# EAGLE design Lixie_Master (EAGLE 7.7.0)
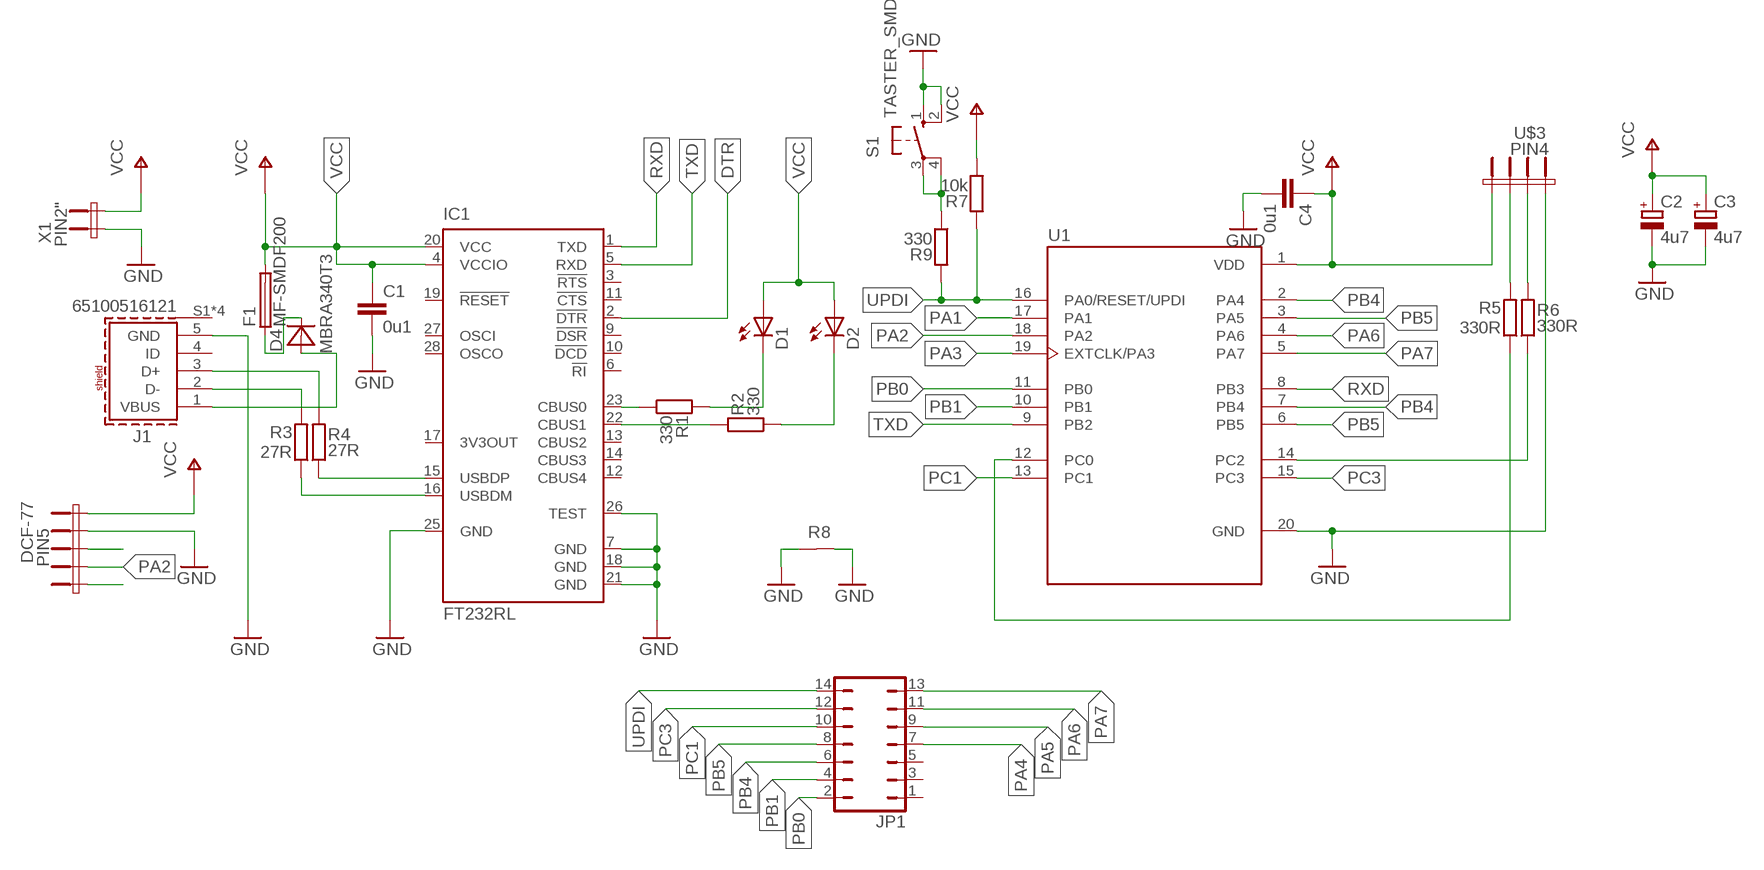
[diagram p0: schematic, sheet 1]

## Parts
C1  0u1  C-EUC0805  [C0805]
C2  4u7  CPOL-EU153CLV-0405  [153CLV-0405]
C3  4u7  CPOL-EU153CLV-0405  [153CLV-0405]
C4  0u1  C-EUC0805  [C0805]
D1  LED1206  [1206]
D2  LED1206  [1206]
D4  MBRA340T3  [SMA]
DCF-77  PIN5  [PIN5]
F1  MF-SMDF200  [MF-SMDF050]
IC1  FT232RL  [SSOP28]
J1  65100516121  [65100516121]
JP1  JP7Q  [JP7Q]
R1  330  R0805  [R0805]
R2  330  R0805  [R0805]
R3  27R  R1206  [R1206]
R4  27R  R1206  [R1206]
R5  330R  R1206  [R1206]
R6  330R  R1206  [R1206]
R7  10k  R0805  [R0805]
R8  R0/10  [R0/10]
R9  330  R0805  [R0805]
S1  TASTER_SMD  [TASTER_SMD]
U1  ATTINY-406SN  [SOIC127P1032X265-20N]
U$3  PIN4  [PIN4_P]
X1  PIN2"  [PIN2]

## Nets
DTR: IC1.2(!DTR)
GND: C1.2 C2.- C3.- C4.2 DCF-77.4 IC1.7(GND) IC1.18(GND) IC1.21(GND) IC1.25(GND) IC1.26(TEST) J1.5(GND) R8.1 R8.2 S1.1(S) S1.2(S1) U1.20(GND) U$3.4 X1.P$2(KL1)
N$1: J1.3(D+) R4.2
N$2: IC1.16(USBDM) R3.1
N$3: IC1.23(CBUS0) R1.1
N$4: J1.2(D-) R3.2
N$5: D1.C R1.2
N$6: IC1.22(CBUS1) R2.2
N$7: D2.C R2.1
N$8: R5.1 U1.12(PC0)
N$9: R6.1 U1.14(PC2)
N$10: IC1.15(USBDP) R4.1
N$11: D4.C F1.1
N$12: R5.2 U$3.2
N$13: R6.2 U$3.3
N$14: D4.A J1.1(VBUS)
N$15: DCF-77.3
N$16: R9.1 S1.3(P) S1.4(P1)
N$17: DCF-77.1
PA1: U1.17(PA1)
PA2: DCF-77.2 U1.18(PA2)
PA3: U1.19(EXTCLK/PA3)
PA4: JP1.7
PA5: JP1.9
PA6: JP1.11 U1.4(PA6)
PA7: JP1.13 U1.5(PA7)
PB0: JP1.2 U1.11(PB0)
PB1: JP1.4 U1.10(PB1)
PB4: JP1.6 U1.2(PA4) U1.7(PB4)
PB5: JP1.8 U1.3(PA5) U1.6(PB5)
PC1: JP1.10 U1.13(PC1)
PC3: JP1.12 U1.15(PC3)
RXD: IC1.1(TXD) U1.8(PB3)
TXD: IC1.5(RXD) U1.9(PB2)
UPDI: JP1.14 R7.2 R9.2 U1.16(PA0/RESET/UPDI)
VCC: C1.1 C2.+ C3.+ C4.1 D1.A D2.A DCF-77.5 F1.2 IC1.4(VCCIO) IC1.20(VCC) R7.1 U1.1(VDD) U$3.1 X1.P$3(KL2)
Unconnected: IC1.3(!RTS) IC1.6(!RI) IC1.9(!DSR) IC1.10(!DCD) IC1.11(!CTS) IC1.12(CBUS4) IC1.13(CBUS2) IC1.14(CBUS3) IC1.17(3V3OUT) IC1.19(!RESET) IC1.27(OSCI) IC1.28(OSCO) J1.4(ID) J1.S1(SHIELD) J1.S2(SHIELD) J1.S3(SHIELD) J1.S4(SHIELD) JP1.1 JP1.3 JP1.5

## Library data of the parts
C1 C4 = 0_HTL_MegaCard_V3:C-EU: CAPACITOR, European symbol
C2 C3 = rcl:CPOL-EU: POLARIZED CAPACITOR, European symbol
D1 D2 = 0_HTL_analog:LED*: LED
D4 = diode:MBRA340T3: Surface Mount Schottky Power Rectifier Source: http://www.onsemi.com/pub_link/Collateral/MBRA340T3-D.PDF
DCF-77 = 0_HTL_uC-MEGACARD:PIN5
F1 = fuse:MF-SMDF: MF-SMDF Series - PRC Resettable Fuses Source: http://www.farnell.com/datasheets/716597.pdf
IC1 = ftdichip:FT232R: Source: http://www.ftdichip.com/Documents/DataSheets/DS_FT232R_v104.pdf; MPN: FT232RL; OC_FARNELL: 1146032; OC_NEWARK: 91K9918
J1 = 65100516121:65100516121: WR-COM Mini USB 2.0 Type B SMT Horizontal 5 Contacts Kind Properties Durability:1 500 Mating cycles Quality Class:1 500 Mating cycles Connector Type:Mini USB Gender:Receptacle Type:Horizontal General Information Operating Temperature:-40up to +105 °C Compliance:RoHS Electrical Properties IR 1:1A Working Voltage:30V (AC) Withstanding Voltage:750V (AC) Contact Resistance:20 mΩ Material Properties Insulator Material:LCP Insulator Flammability Rating:UL94 V-0 Color:Black Cover Material:Brass Cover Plating:Nickel Contact Material:Copper Alloy Contact Plating: Selective Gold Contact Type:Stamped Shielding Material:Brass Shielding Plating:Nickel <https://www.we-online.com/catalog/media/o33005v209%20Family_WR-COM_65100516121.jpg> Details see: https://www.we-online.com/catalog/en/COM_SMT_MINI_TYPE_B_HORIZONTAL/ Updated by Yingchun, Shan 2020-01-16 2020 (C) Würth Elektronik Check availability <https://pricing.snapeda.com/parts/65100516121/W%C3%BCrth%20Elektronik/view-part?ref=eda>; AVAILABILITY: In Stock; DESCRIPTION: USB - mini B USB 2.0 Receptacle Connector 5 Position Surface Mount, Right Angle; MF: Würth Elektronik; MP: 65100516121; PACKAGE: None; PRICE: None; PURCHASE-URL: https://pricing.snapeda.com/search/part/65100516121/?ref=eda
JP1 = jumper:JP7Q: JUMPER
R1-R7 R9 = 0_HTL_analog:R: Widerstand
R8 = 0_HTL_analog:R0: Brücke (Symbol horizontal) bedrahtet, SMD
S1 = 0_HTL_MegaCard_V3:TASTER_SMD: Taster SMD
U1 = SOIC127P1032X265-20N:ATTINY-406SN: AVR MicroChip ATtiny 406 • CPU: – AVR® 8-bit CPU – Running at up to 20 MHz – Single cycle I/O access – Two-level interrupt controller – Two-cycle hardware multiplier • Memories: – 4 KB In-system self-programmable Flash memory – 128B EEPROM – 256B SRAM – Write/Erase Cycles: 10,000 Flash/100,000 EEPROM – Data Retention: 20 Years at 85°C • System: – Power-on Reset (POR) – Brown-out Detection (BOD) – Clock Options: • 16/20 MHz Low-Power Internal RC Oscillator with: – ±3% Accuracy over full temperature and voltage range – ±2% Drift over limited temperature and 1.8 ... 3.6V voltage range • 32.768 kHz Ultra Low-Power (ULP) Internal RC Oscillator with ±10% Accuracy, ±2% Calibration Step Size • External Clock Input – Single Pin Unified Program Debug Interface (UPDI) – Three Sleep Modes: • Idle with all peripherals running and mode for immediate wake-up time © 2018 Microchip Technology Inc. Datasheet Preliminary DS40001976A-page 1 • Standby – Configurable operation of selected peripherals – SleepWalking peripherals • Power-down with wake-up functionality • Peripherals: – 3-channel Event System – One 16-bit Timer/Counter Type A with Dedicated Period Register, Three Compare Channels (TCA) – One 16-bit Timer/Counter Type B with Input Capture (TCB) – One 16-bit Real-Time Counter (RTC) running from Internal RC Oscillator – One USART with fractional Baud Rate Generator, Auto-baud, and Start-of-frame Detection – Master/Slave Serial Peripheral Interface (SPI) – Master/Slave TWI with Dual Address Match • Standard mode (Sm, 100 kHz) • Fast mode (Fm, 400 kHz) • Fast mode Plus (Fm+, 1 MHz) – Configurable Custom Logic (CCL) with Two Programmable Look-up Tables (LUT) – Analog Comparator (AC) – 10-bit 115 ksps Analog-to-Digital Converter (ADC) – Five selectable internal voltage references: 0.55V, 1.1V, 1.5V, 2.5V, and 4.3V – Automated CRC memory scan – Watchdog Timer (WDT) with Window mode, with separate on-chip oscillator – External interrupt on all general purpose pins • I/O and Packages: – 18 Programmable I/O lines – 20-pin VQFN and SOIC300 • Temperature Ranges: – -40°C to 105°C – -40°C to 125°C Temperature graded device options available • Speed Grades: – 0-5 MHz @ 1.8V – 5.5V – 0-10 MHz @ 2.7V – 5.5V – 0-20 MHz @ 4.5V – 5.5V; UP1: ATTINY-406
U$3 = zkseagle:PIN4
X1 = 0_HTL_uC-MEGACARD:PIN2

## Board
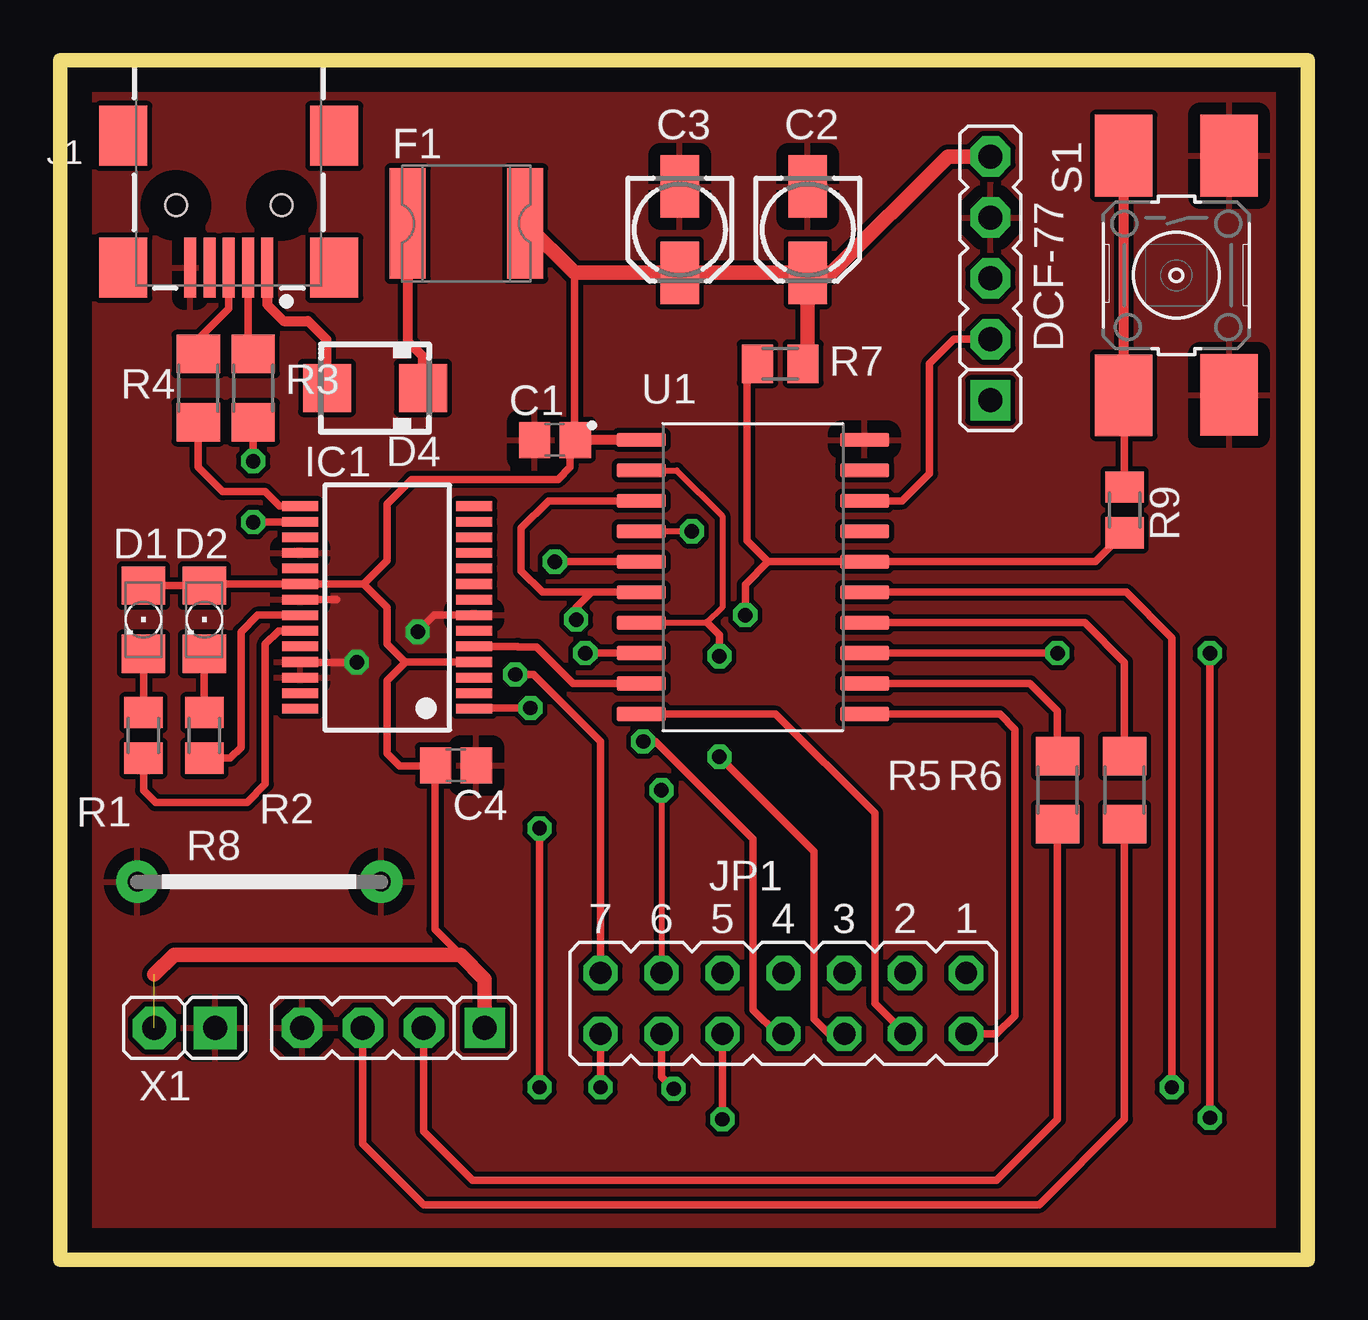
[diagram p1: board, top side]
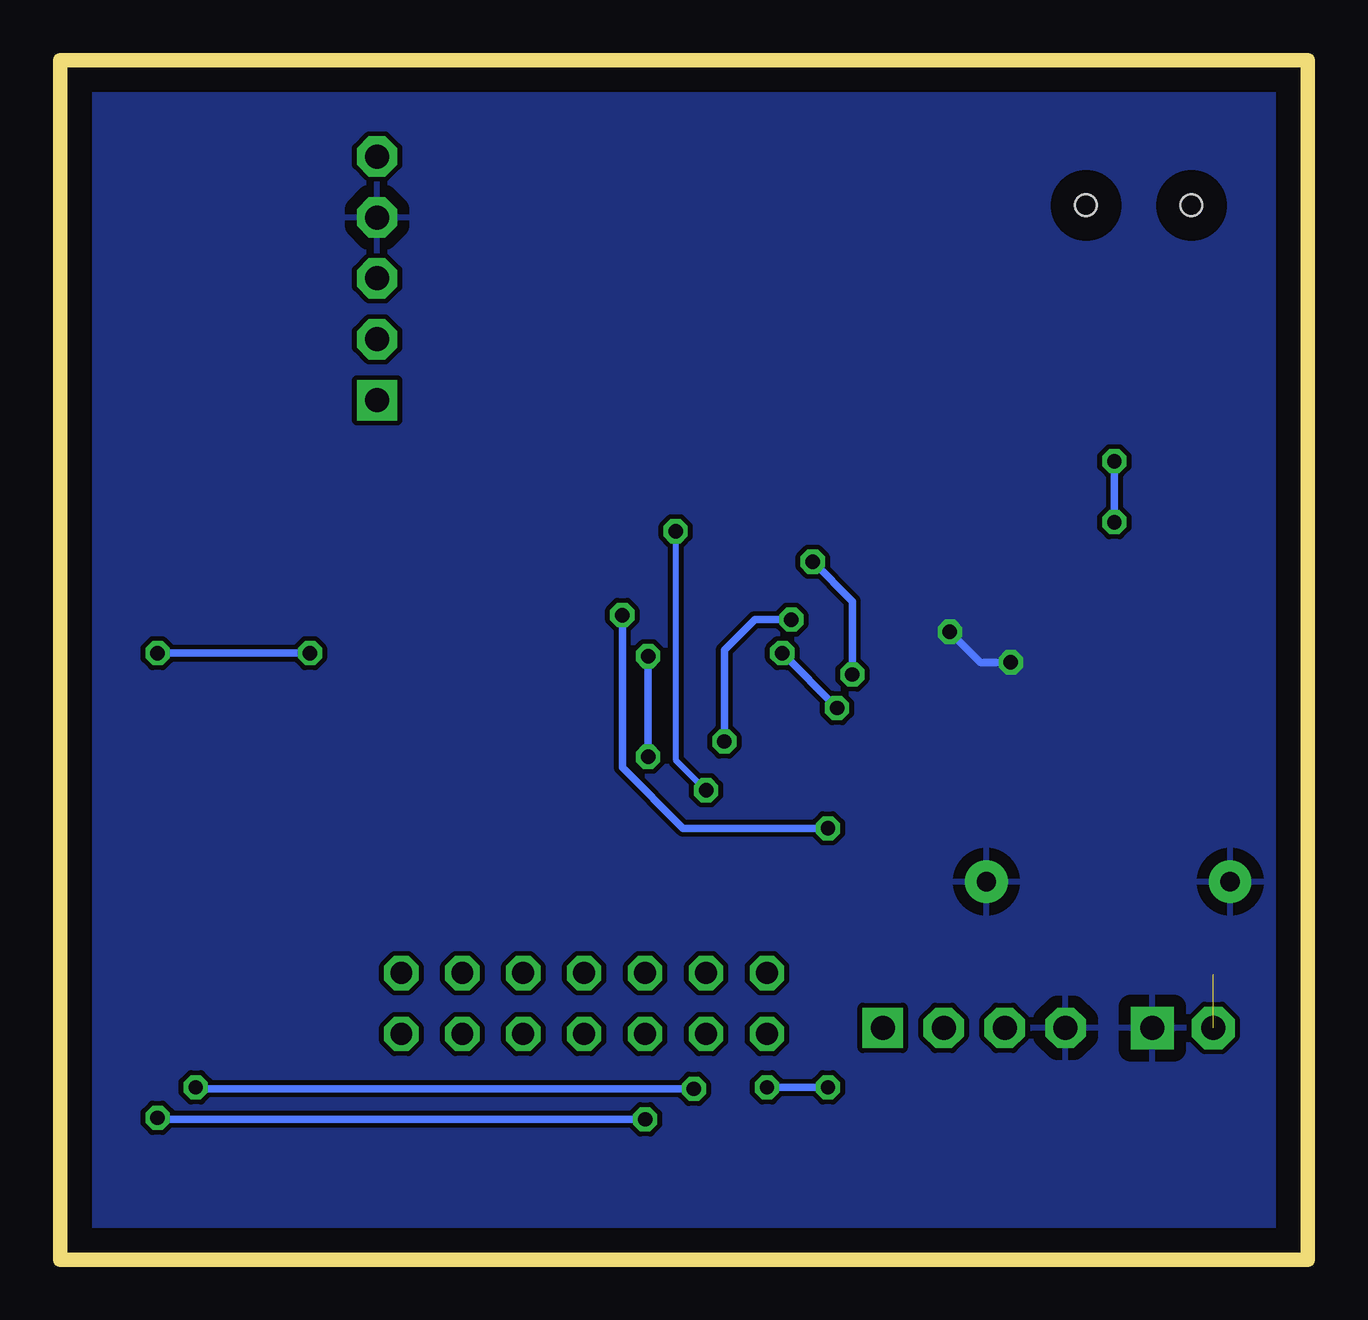
[diagram p2: board, bottom side, seen from below]

Size 52 x 50 mm. Coordinates in mm from the lower left corner, seen from the top.
Outline: 0,0 52,0 52,50 0,50 0,0
Copper layers (1*16): Top 0.035mm / dielectric 1.5mm / Bottom 0.035mm
Design rules "default *": minimum track width 10mil, minimum drill 20mil, track to track 8mil, track to pad 8mil, pad to pad 8mil, via to via 8mil, smd to smd 8mil, copper to edge 40mil, drill to drill 8mil, minimum pad ring 10mil, minimum via ring 8mil, stop-mask expansion 4mil, vias tented up to drill 0mil, thermal gap 20mil

### Footprints (pad centres in the part's own frame; a part is rotated, then mirrored left to right if it is on the bottom)
C0805 = smd 1.3 x 1.5: 1 -0.85,0; 2 0.85,0
153CLV-0405 = smd 2.6 x 1.6: + 1.8,0; - -1.8,0
1206 = smd 1.6 x 1.803: A -1.422,0; C 1.422,0
SMA = smd 2 x 2: A 2,0; C -2,0
PIN5 = drill 1 pad 1.676 square: 1 -7.62,0 | drill 1 pad 1.676 octagon: 2 -5.08,0; 3 -2.54,0; 4 0,0; 5 2.54,0
MF-SMDF050 = smd 1.5 x 4.6: 1 -2.45,0; 2 2.45,0
SSOP28 = smd 0.4 x 1.5: 1 -4.225,-3.625; 2 -3.575,-3.625; 3 -2.925,-3.625; 4 -2.275,-3.625; 5 -1.625,-3.625; 6 -0.975,-3.625; 7 -0.325,-3.625; 8 0.325,-3.625; 9 0.975,-3.625; 10 1.625,-3.625; 11 2.275,-3.625; 12 2.925,-3.625; 13 3.575,-3.625; 14 4.225,-3.625; 15 4.225,3.625; 16 3.575,3.625; 17 2.925,3.625; 18 2.275,3.625; 19 1.625,3.625; 20 0.975,3.625; 21 0.325,3.625; 22 -0.325,3.625; 23 -0.975,3.625; 24 -1.625,3.625; 25 -2.275,3.625; 26 -2.925,3.625; 27 -3.575,3.625; 28 -4.225,3.625
65100516121 = smd 0.5 x 2.5: 1 -1.6,3.875; 2 -0.8,3.875; 3 0,3.875; 4 0.8,3.875; 5 1.6,3.875 | smd 2 x 2.5: S1 -4.4,3.875; S2 4.4,3.875; S3 4.4,-1.625; S4 -4.4,-1.625 | hole 0.9: -2.2,1.275; 2.2,1.275
JP7Q = drill 0.914 octagon: 1 -7.62,-1.27; 2 -7.62,1.27; 3 -5.08,-1.27; 4 -5.08,1.27; 5 -2.54,-1.27; 6 -2.54,1.27; 7 0,-1.27; 8 0,1.27; 9 2.54,-1.27; 10 2.54,1.27; 11 5.08,-1.27; 12 5.08,1.27; 13 7.62,-1.27; 14 7.62,1.27
R0805 = smd 1.3 x 1.6: 1 -0.95,0; 2 0.95,0
R1206 = smd 1.6 x 1.803: 1 -1.422,0; 2 1.422,0
R0/10 = drill 0.8 pad 1.778: 1 -5.08,0; 2 5.08,0
TASTER_SMD = smd 3.4 x 2.4: 1 -4.987,2.203; 2 4.989,2.202; 3 -4.989,-2.193; 4 5,-2.197
SOIC127P1032X265-20N = smd 2.05 x 0.6: 1 -4.655,5.715; 2 -4.655,4.445; 3 -4.655,3.175; 4 -4.655,1.905; 5 -4.655,0.635; 6 -4.655,-0.635; 7 -4.655,-1.905; 8 -4.655,-3.175; 9 -4.655,-4.445; 10 -4.655,-5.715; 11 4.655,-5.715; 12 4.655,-4.445; 13 4.655,-3.175; 14 4.655,-1.905; 15 4.655,-0.635; 16 4.655,0.635; 17 4.655,1.905; 18 4.655,3.175; 19 4.655,4.445; 20 4.655,5.715
PIN4_P = drill 1 pad 1.676 square: 1 -7.62,0 | drill 1 pad 1.676 octagon: 2 -5.08,0; 3 -2.54,0; 4 0,0
PIN2 = drill 1 pad 1.778 square: P$2 -1.27,0 | drill 1 pad 1.778 octagon: P$3 1.27,0

### Placement (x,y rotation side)
C1  20.62,34.16 180 top
C2  31.17,42.93 270 top
C3  25.83,42.93 270 top
C4  16.5,20.6 0 top
D1  3.48,26.67 270 top
D2  6.02,26.67 270 top
D4  13.13,36.32 180 top
DCF-77  38.79,43.44 90 top
F1  16.94,43.18 0 top
IC1  13.64,27.18 90 top
J1  7.04,45.21 180 top
JP1  30.15,10.67 180 top
R1  3.48,21.85 90 top
R2  6.02,21.85 270 top
R3  8.05,36.32 90 top
R4  5.77,36.32 90 top
R5  41.58,19.56 270 top
R6  44.37,19.56 270 top
R7  30.02,37.34 180 top
R8  8.31,15.75 0 top
R9  44.37,31.24 270 top
S1  46.53,41.02 270 top
U1  28.88,28.45 0 top
U$3  10.08,9.65 180 top
X1  5.2,9.65 180 top

### Tracks (layer width: path | path; a pad name or v marks a point on that pad's centre or on a via)
GND  (via drill 0.6)
  Top 0.305: IC1.21 11.54,27.51 | v12.37,24.89 10.03,24.89 IC1.25 | IC1.7 15.6,26.85 v14.91,26.16
  Bottom 0.305: v12.37,24.89 13.64,24.89 v14.91,26.16
  pour Top: 0.69,49.27 0.94,1.01 51.24,1.01 51.24,49.27
  pour Bottom: 0.69,49.27 0.94,1.01 51.24,1.01 51.24,49.27
N$1
  Top 0.305: R4.2 5.77,38.36 7.04,39.63 J1.3
N$2  (via drill 0.6)
  Top 0.305: R3.1 v8.05,33.28 | v8.05,30.74 10,30.74 IC1.16
  Bottom 0.305: v8.05,33.28 v8.05,30.74
N$3
  Top 0.305: R1.1 3.48,19.56 3.99,19.05 7.8,19.05 8.56,19.81 8.56,25.66 9.11,26.2 IC1.23
N$4
  Top 0.305: J1.2 7.84,37.96 R3.2
N$5
  Top 0.305: D1.C R1.2
N$6
  Top 0.305: R2.2 7.1,20.9 7.54,21.34 7.54,26.16 8.23,26.85 IC1.22
N$7
  Top 0.305: D2.C R2.1
N$8
  Top 0.305: R5.1 41.58,22.86 40.44,24.01 U1.12
N$9
  Top 0.305: U1.14 42.72,26.55 44.37,24.89 R6.1
N$10
  Top 0.305: IC1.15 9.16,31.41 8.56,32.01 6.78,32.01 5.77,33.02 R4.1
N$11
  Top 0.406: D4.C 15.13,37.63 14.49,38.27 F1.1
N$12
  Top 0.305: R5.2 41.58,5.84 39.04,3.3 17.2,3.3 15.16,5.34 U$3.2
N$13
  Top 0.305: U$3.3 12.62,4.83 15.16,2.29 40.82,2.29 44.37,5.84 R6.2
N$14
  Top 0.406: J1.1 8.64,39.8 9.32,39.12 10.34,39.12 11.1,38.36 11.1,36.36 D4.A
N$16
  Top 0.305: R9.1 44.37,35.98 S1.4
  Top 0.406: S1.4 S1.3
PA2
  Top 0.305: U1.18 35.1,31.62 36.25,32.77 36.25,37.34 37.26,38.36 DCF-77.2
PA6  (via drill 0.6)
  Top 0.254: U1.4 v26.34,30.35 | v25.07,19.56 JP1.11
  Bottom 0.254: v26.34,30.35 26.34,20.83 v25.07,19.56
PA7  (via drill 0.6)
  Top 0.305: JP1.13 22.53,21.59 19.74,24.39 v18.97,24.39 | v20.62,29.09 U1.5
  Bottom 0.305: v18.97,24.39 18.97,27.43 v20.62,29.09
PB0
  Top 0.305: JP1.2 39.04,9.4 39.8,10.16 39.8,22.1 39.17,22.73 U1.11
PB1
  Top 0.305: JP1.4 33.96,10.67 33.96,18.61 29.83,22.73 U1.10
PB4  (via drill 0.6)
  Top 0.254: U1.2 25.7,32.9 27.61,30.99 27.61,27.18 26.98,26.55 U1.7
  Top 0.305: JP1.6 32.05,9.4 31.42,10.04 31.42,17.02 v27.48,20.96 | v27.48,25.15 27.48,26.04 26.98,26.55
  Bottom 0.305: v27.48,20.96 v27.48,25.15
PB5  (via drill 0.6)
  Top 0.305: U1.3 20.37,31.62 19.23,30.48 19.23,28.7 20.12,27.81 22.15,27.81 | JP1.8 29.9,9.4 28.88,10.42 28.88,17.53 24.82,21.59 v24.31,21.59 | v21.51,26.67 21.51,27.18 22.15,27.81 | 22.15,27.81 22.28,27.81 U1.6
  Bottom 0.305: v24.31,21.59 24.31,25.4 23.04,26.67 v21.51,26.67
PC1  (via drill 0.6)
  Top 0.305: JP1.10 v27.61,5.84 | v47.93,5.91 v47.93,25.27 | v41.58,25.27 U1.13
  Bottom 0.305: v27.61,5.84 47.87,5.84 v47.93,5.91 | v47.93,25.27 v41.58,25.27
PC3  (via drill 0.6)
  Top 0.305: U1.15 44.44,27.81 46.34,25.91 v46.34,7.18 | JP1.12 25.07,7.62 v25.58,7.11
  Bottom 0.305: v25.58,7.11 46.28,7.11 v46.34,7.18
RXD  (via drill 0.6)
  Top 0.305: U1.8 v21.9,25.27 | v19.61,22.99 17.3,22.99 IC1.1
  Bottom 0.305: v21.9,25.27 v19.61,22.99
TXD
  Top 0.305: IC1.5 19.08,25.55 19.1,25.53 19.86,25.53 21.39,24.01 U1.9
UPDI  (via drill 0.6)
  Top 0.305: JP1.14 v22.53,7.18 | v19.99,7.18 v19.99,17.97 | v28.56,26.86 28.56,28.13 29.52,29.09 | 29.52,29.09 U1.16 43.17,29.09 R9.2 | 29.52,29.09 28.63,29.97 28.63,36.89 R7.2
  Bottom 0.305: v22.53,7.18 v19.99,7.18 | v19.99,17.97 26.02,17.97 28.56,20.51 v28.56,26.86
VCC  (1 unrouted)
  Top 0.254: 21.26,33.95 C1.1
  Top 0.305: D1.A D2.A 6.08,28.16 IC1.20 12.66,28.16 | IC1.4 14.39,24.91 | 14.39,24.91 13.64,25.66 13.64,27.18 12.66,28.16 | 14.39,24.91 14.39,24.88 13.64,24.13 13.64,21.08 14.15,20.58 15.63,20.58 | 15.63,20.58 C4.1 | 21.45,41.13 21.45,34.19 C1.1 | 21.26,33.95 21.26,33.02 20.75,32.51 14.66,32.51 13.64,31.5 13.64,29.13 12.66,28.16 | 15.63,20.58 15.63,13.76 16.69,12.7
  Top 0.406: U1.1 C1.1
  Top 0.61: F1.2 21.45,41.13 C3.+ C2.+ | 3.93,11.88 4.75,12.7 16.69,12.7 17.7,11.69 U$3.1 | C2.+ 32.16,41.13 37.01,45.98 DCF-77.5 38.82,46.01 | C2.+ 31.17,37.53 R7.1

### Text on the board
tDrill: Material: FR4 1,5mm 35u Cu | Toleranz: Aussenmass -0,5mm, sonst +/_0,2mm | Bohrplan | SYM | SIZE | CNT | 0.60 mm | 20 | 0.80 mm | 2 | 0.90 mm | 2 | 0.90 mm | 14 | 1.00 mm | 11 | TOTAL | 49
bDrill: Material: FR4 1,5mm 35u Cu | Toleranz: Aussenmass -0,5mm, sonst +/_0,2mm | Bohrplan | CNT | SIZE | SYM | 20 | 0.60 mm | 2 | 0.80 mm | 2 | 0.90 mm | 14 | 0.90 mm | 11 | 1.00 mm | 49 | TOTAL